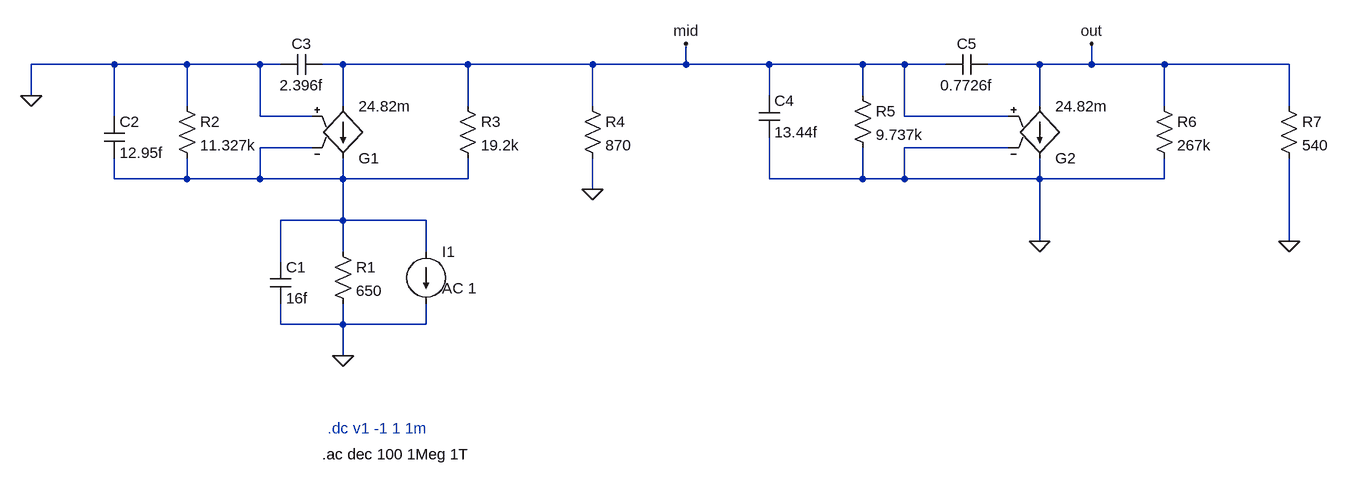
[diagram p0: schematic Draft2.asc]
Draft2.asc, the LTspice schematic file:
Version 4
SHEET 1 1604 680
WIRE -272 16 -400 16
WIRE -160 16 -272 16
WIRE -48 16 -160 16
WIRE -16 16 -48 16
WIRE 80 16 48 16
WIRE 272 16 80 16
WIRE 464 16 272 16
WIRE 608 16 608 -16
WIRE 608 16 464 16
WIRE 736 16 608 16
WIRE 880 16 736 16
WIRE 944 16 880 16
WIRE 1008 16 944 16
WIRE 1152 16 1072 16
WIRE 1232 16 1232 -16
WIRE 1232 16 1152 16
WIRE 1344 16 1232 16
WIRE 1536 16 1344 16
WIRE -400 64 -400 16
WIRE 736 64 736 16
WIRE 880 64 880 16
WIRE -160 80 -160 16
WIRE 80 80 80 16
WIRE 272 80 272 16
WIRE 464 80 464 16
WIRE 1152 80 1152 16
WIRE 1344 80 1344 16
WIRE 1536 80 1536 16
WIRE -272 96 -272 16
WIRE -48 96 -48 16
WIRE 32 96 -48 96
WIRE 944 96 944 16
WIRE 1104 96 944 96
WIRE 32 144 -48 144
WIRE 1104 144 944 144
WIRE -272 192 -272 160
WIRE -160 192 -160 160
WIRE -160 192 -272 192
WIRE -48 192 -48 144
WIRE -48 192 -160 192
WIRE 80 192 80 160
WIRE 80 192 -48 192
WIRE 272 192 272 160
WIRE 272 192 80 192
WIRE 736 192 736 128
WIRE 880 192 880 144
WIRE 880 192 736 192
WIRE 944 192 944 144
WIRE 944 192 880 192
WIRE 1152 192 1152 160
WIRE 1152 192 944 192
WIRE 1344 192 1344 160
WIRE 1344 192 1152 192
WIRE 464 208 464 160
WIRE 80 256 80 192
WIRE 80 256 -16 256
WIRE 208 256 80 256
WIRE 1152 288 1152 192
WIRE 1536 288 1536 160
WIRE 80 304 80 256
WIRE 208 304 208 256
WIRE -16 320 -16 256
WIRE -16 416 -16 384
WIRE 80 416 80 384
WIRE 80 416 -16 416
WIRE 208 416 208 384
WIRE 208 416 80 416
WIRE 80 464 80 416
FLAG 80 464 0
FLAG -400 64 0
FLAG 464 208 0
FLAG 1152 288 0
FLAG 1536 288 0
FLAG 608 -16 mid
FLAG 1232 -16 out
SYMBOL current 208 304 R0
WINDOW 123 24 56 Left 2
WINDOW 39 0 0 Left 0
WINDOW 3 24 28 Left 2
SYMATTR Value2 AC 1
SYMATTR InstName I1
SYMATTR Value ""
SYMBOL g2 80 176 M180
SYMATTR InstName G1
SYMATTR Value 24.82m
SYMBOL res 64 288 R0
SYMATTR InstName R1
SYMATTR Value 650
SYMBOL cap -32 320 R0
SYMATTR InstName C1
SYMATTR Value 16f
SYMBOL res -176 64 R0
SYMATTR InstName R2
SYMATTR Value 11.327k
SYMBOL res 256 64 R0
SYMATTR InstName R3
SYMATTR Value 19.2k
SYMBOL res 448 64 R0
SYMATTR InstName R4
SYMATTR Value 870
SYMBOL cap -288 96 R0
SYMATTR InstName C2
SYMATTR Value 12.95f
SYMBOL cap 48 0 R90
WINDOW 0 0 32 VBottom 2
WINDOW 3 32 32 VTop 2
SYMATTR InstName C3
SYMATTR Value 2.396f
SYMBOL cap 720 64 R0
SYMATTR InstName C4
SYMATTR Value 13.44f
SYMBOL cap 1072 0 R90
WINDOW 0 0 32 VBottom 2
WINDOW 3 32 32 VTop 2
SYMATTR InstName C5
SYMATTR Value 0.7726f
SYMBOL res 864 48 R0
SYMATTR InstName R5
SYMATTR Value 9.737k
SYMBOL res 1328 64 R0
SYMATTR InstName R6
SYMATTR Value 267k
SYMBOL res 1520 64 R0
SYMATTR InstName R7
SYMATTR Value 540
SYMBOL g2 1152 176 M180
SYMATTR InstName G2
SYMATTR Value 24.82m
TEXT 48 616 Left 2 !.ac dec 100 1Meg 1T
TEXT 56 576 Left 2 ;.dc v1 -1 1 1m

The netlist it stands for:
* Draft2.asc
I1 N001 0 AC 1
G1 mid N001 0 N001 24.82m
R1 N001 0 650
C1 N001 0 16f
R2 0 N001 11.327k
R3 mid N001 19.2k
R4 mid 0 870
C2 0 N001 12.95f
C3 mid 0 2.396f
C4 mid 0 13.44f
C5 out mid 0.7726f
R5 mid 0 9.737k
R6 out 0 267k
R7 out 0 540
G2 out 0 mid 0 24.82m
.ac dec 100 1Meg 1T
* .dc v1 -1 1 1m
.backanno
.end